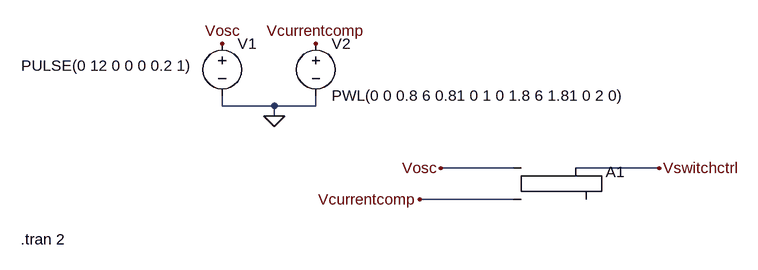
[diagram p0: schematic pwm.asc]
pwm.asc, the LTspice schematic file:
Version 4
SHEET 1 880 680
WIRE -336 32 -336 16
WIRE -256 32 -336 32
WIRE -192 32 -192 16
WIRE -192 32 -256 32
WIRE -256 48 -256 32
WIRE 112 128 0 128
WIRE 336 128 208 128
WIRE 112 176 -32 176
FLAG 0 128 Vosc
FLAG -32 176 Vcurrentcomp
FLAG 336 128 Vswitchctrl
FLAG -336 -64 Vosc
FLAG -192 -64 Vcurrentcomp
FLAG -256 48 0
SYMBOL Digital\\srflop 160 80 R0
SYMATTR InstName A1
SYMATTR SpiceLine Trise=5n Tfall=5n Td=5n
SYMATTR Value2 Vhigh=12 Vlow=0
SYMBOL voltage -336 -80 R0
WINDOW 3 -309 50 Left 2
WINDOW 123 0 0 Left 0
WINDOW 39 0 0 Left 0
SYMATTR InstName V1
SYMATTR Value PULSE(0 12 0 0 0 0.2 1)
SYMBOL voltage -192 -80 R0
WINDOW 123 0 0 Left 0
WINDOW 39 0 0 Left 0
SYMATTR InstName V2
SYMATTR Value PWL(0 0 0.8 6 0.81 0 1 0 1.8 6 1.81 0 2 0)
TEXT -646 238 Left 2 !.tran 2

The netlist it stands for:
* pwm.asc
A1 Vosc Vcurrentcomp 0 0 0 0 Vswitchctrl 0 SRFLOP Vhigh=12 Vlow=0 Trise=5n Tfall=5n Td=5n
V1 Vosc 0 PULSE(0 12 0 0 0 0.2 1)
V2 Vcurrentcomp 0 PWL(0 0 0.8 6 0.81 0 1 0 1.8 6 1.81 0 2 0)
.tran 2
.backanno
.end